# Altium project PowerMonitoring.PrjPcb
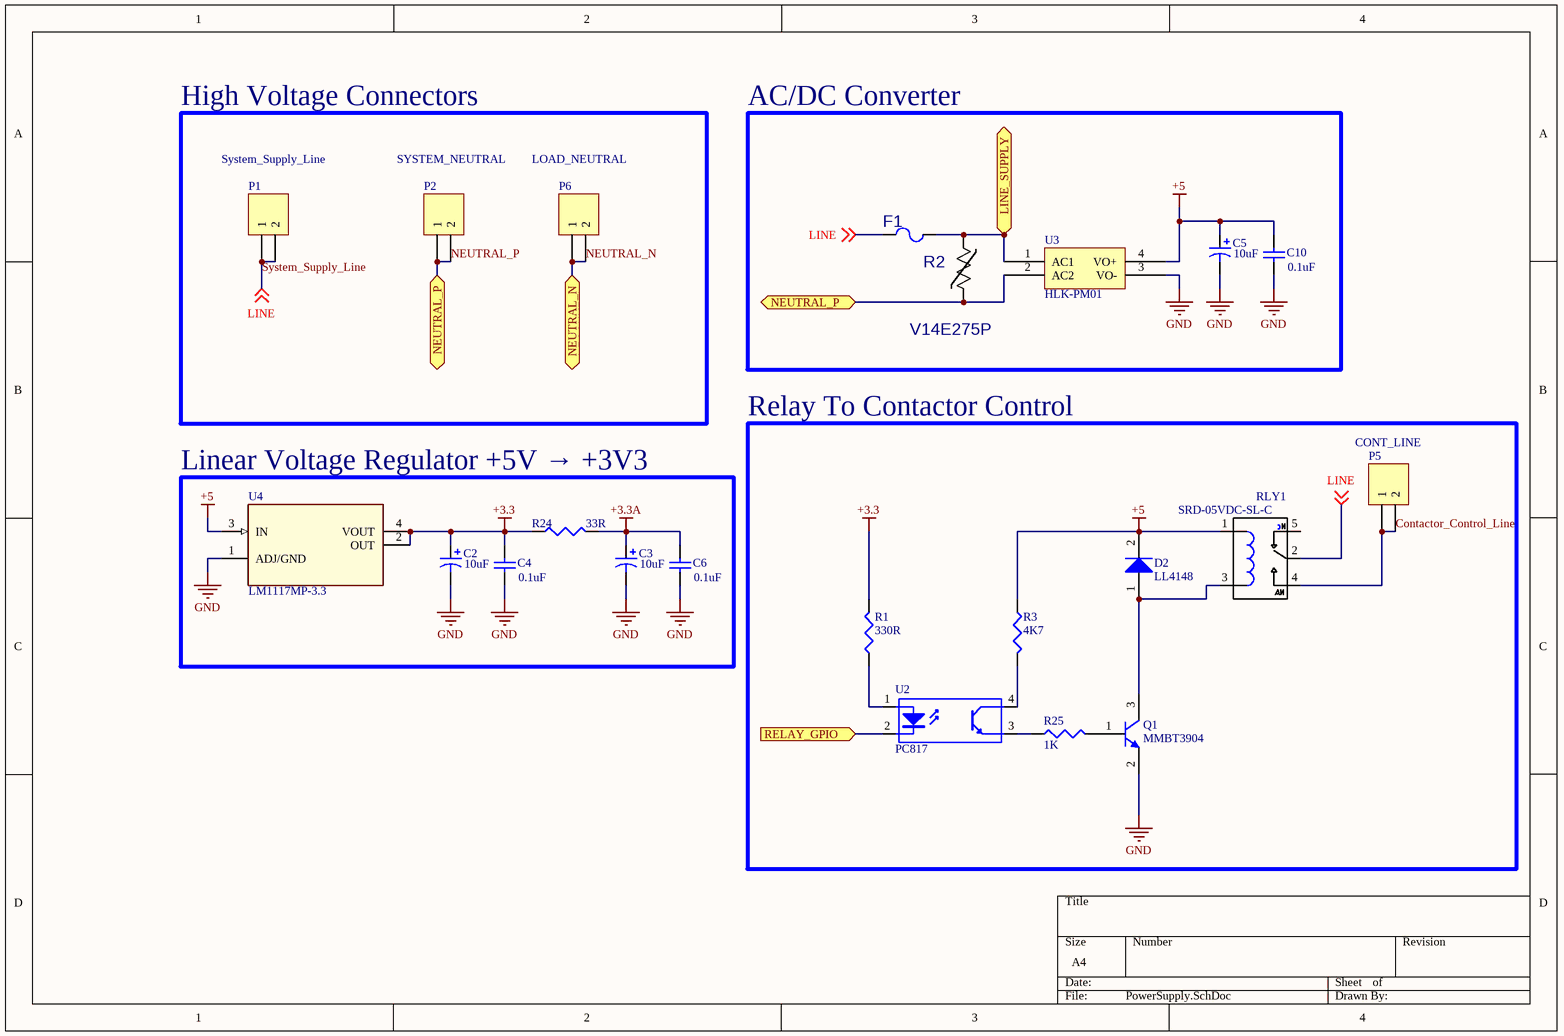
[diagram p0: PowerSupply.SchDoc]
3 sheets, 65 parts. Net scope: flat (ports and power ports of the same name join across sheets).
Board file: PowerMonitoring.PcbDoc
Sheets:
  PowerSupply.SchDoc
  CoreProcessor.SchDoc
  Meter.SchDoc

## Sheet PowerSupply.SchDoc
size A4

### Parts
C2  value 10uF  [EEE-1VA100WR]  (hidden comment: Cap Pol1)
C3  value 10uF  [EEE-1VA100WR]  (hidden comment: Cap Pol1)
C4  value 0.1uF  [C0603]  (hidden comment: MUDAR FOOTPRINT)
C5  value 10uF  [EEE-1VA100WR]  (hidden comment: Cap Pol1)
C6  value 0.1uF  [C0603]  (hidden comment: MUDAR FOOTPRINT)
C10  value 0.1uF  [C0603]  (hidden comment: MUDAR FOOTPRINT)
D2  LL4148  [LL4148]
F1  RSTA 1 AMMO  [RSTA]  (value not drawn)
P1  System_Supply_Line  [1993763]
P2  SYSTEM_NEUTRAL  [1993763]
P5  CONT_LINE  [1993763]
P6  LOAD_NEUTRAL  [1993763]
Q1  MMBT3904  [SOT-233]
R1  value 330R  [R0603]  (hidden comment: Res3)
R2  value V14E275P  [VARISTOR]  (hidden comment: ERZ-V14D431)
R3  value 4K7  [R0603]  (hidden comment: Res3)
R24  value 33R  [R0603]  (hidden comment: Res3)
R25  value 1K  [R0603]  (hidden comment: Res3)
RLY1  SRD-05VDC-SL-C  [srd-05vdc]
U2  PC817  [SOT254P975X400-4N]
U3  HLK-PM01  [HLK-PM01]
U4  LM1117MP-3.3  [LM1117]

### Blocks framed on the sheet
High Voltage Connectors: P1 P2 P6
AC/DC Converter: C5 C10 F1 R2 U3
Relay To Contactor Control: D2 P5 Q1 R1 R3 R25 RLY1 U2
Linear Voltage Regulator +5V → +3V3: C2-C4 C6 R24 U4

### Ports
LINE_SUPPLY (bidir), NEUTRAL_N (bidir), NEUTRAL_P (bidir), RELAY_GPIO (in)

### Nets
+3.3: C2.1 C4.2 R1.2 R24.1 U4.2(OUT) U4.4(VOUT)
+3.3A: C3.1 C6.2 R24.2
+5: C5.1 C10.2 D2.2(K) R3.1 RLY1.1 U3.4(VO+) U4.3(IN)
GND: C2.2 C3.2 C4.1 C5.2 C6.1 C10.1 Q1.2(E) U3.3(VO-) U4.1(ADJ/GND)  [project net AGND]
Contactor_Control_Line: P5.1 P5.2 RLY1.4
NEUTRAL_N: P6.1 P6.2 ; port NEUTRAL_N
NEUTRAL_P: P2.1 P2.2 R2.2 U3.2(AC2) ; port NEUTRAL_P
RELAY_GPIO: U2.2(K) ; port RELAY_GPIO
System_Supply_Line: F1.1 P1.1 P1.2 RLY1.2 ; off-sheet LINE  [also labelled LINE]
NetD2_1: D2.1(A) Q1.3(C) RLY1.3
NetF1_2: F1.2 R2.1 U3.1(AC1) ; port LINE_SUPPLY
NetQ1_1: Q1.1(B) R25.2
NetR1_1: R1.1 U2.1(A)
NetR3_2: R3.2 U2.4(C)
NetR25_1: R25.1 U2.3(E)

Not connected (* = marked no-connect by the designer): RLY1 5

### Library data of the parts
C2 C3 C5 = Cap Pol1: Polarized Capacitor (Radial); Published: 8-Jun-2000; LatestRevisionDate: 17-Jul-2002; LatestRevisionNote: Re-released for DXP Platform.; PackageReference: RB7.6-15; Publisher: Altium Limited; PackageDescription: Polarized Capacitor (Radial); 2 Leads
C4 C6 C10 = Cap Semi: Capacitor (Semiconductor SIM Model); Published: 8-Jun-2000; LatestRevisionDate: 29-May-2009; LatestRevisionNote: IPC-7351 Footprint Added.; PackageReference: C1206; Publisher: Altium Limited; PackageDescription: Chip Capacitor
D2 = Diode: Default Diode; Published: 8-Jun-2000; LatestRevisionDate: 17-Jul-2002; LatestRevisionNote: Re-released for DXP Platform.; PackageVersion: Sep-1996; PackageReference: SMC; Publisher: Altium Limited; PackageDescription: DO-214-AB/SMC; 2 C-Bend Leads; Body 7.9 x 5.9 mm, inc. leads (LxW); Code_JEDEC: DO-214-AB
F1 = RSTA 1 AMMO: Built_By: EMA_UL_Team; Vendor: BelFuse; Value: RSTA 1 AMMO; Manufacturer_Part_Number: RSTA 1 AMMO
P1 P2 P5 P6 = Header 2: Header, 2-Pin; LatestRevisionDate: 17-Jul-2002; LatestRevisionNote: Re-released for DXP Platform.; Publisher: Altium Limited
Q1 = NPN: NPN Bipolar Transistor; Published: 8-Jun-2000; LatestRevisionDate: 17-Jul-2002; LatestRevisionNote: Re-released for DXP Platform.; PackageReference: TO-226-AA; Publisher: Altium Limited; PackageDescription: TO, Flat Index; 3 In-Line, Axial Leads; Body Dia. 4.8mm; Leads 0.55 x 0.51 mm (max); Code_JEDEC: TO-226-AA
R1 R3 R24 R25 = Res3: Resistor; Published: 8-Jun-2000; LatestRevisionDate: 29-May-2009; LatestRevisionNote: IPC-7351 Footprint Added.; PackageReference: J1-0603; Publisher: Altium Limited; PackageDescription: Chip Resistor
R2 = ERZ-V14D431: C: Copyright (C) 2015 Accelerated Designs. All rights reserved; Vendor: Panasonic; Built_By: EMA_UL_Team; Manufacturer_Part_Number: ERZ-V14D431
RLY1 = SRD-05VDC-SL-C: 5V Trigger Relay Module For Arduino And Raspberry Pi 5V Trigger Relay Module For Arduino And Raspberry Pi; MF: MCM Electronics; Price: None; MP: SRD-05VDC-SL-C; Package: None; Availability: Unavailable; SnapEDA_Link: https://www.snapeda.com/parts/SRD-05VDC-SL-C/MCM%20Electronics/view-part/?ref=snap; Value: *
U2 = Optoisolator1: 4-Pin Phototransistor Optocoupler; Published: 24-Mar-1999; LatestRevisionDate: 04-Mar-2005; LatestRevisionNote: Sch pins 3 & 4 Swapped.; DatasheetVersion: Nov-2003; PackageReference: DIP-4; Publisher: Altium Limited
U4 = LM1117MP-3.3: LDO Regulator Pos 3.3V 0.8A 4-Pin_3+Tab_ SOT-223 T/R; MF: Texas Instruments; Package: SOT-223 Texas Instruments; MP: LM1117MP-3.3; Availability: Good; SnapEDA_Link: https://www.snapeda.com/parts/LM1117MP-3.3/Texas%20Instruments/view-part/?ref=snap; Price: 0.62 USD; Value: *

## Sheet CoreProcessor.SchDoc
size A4
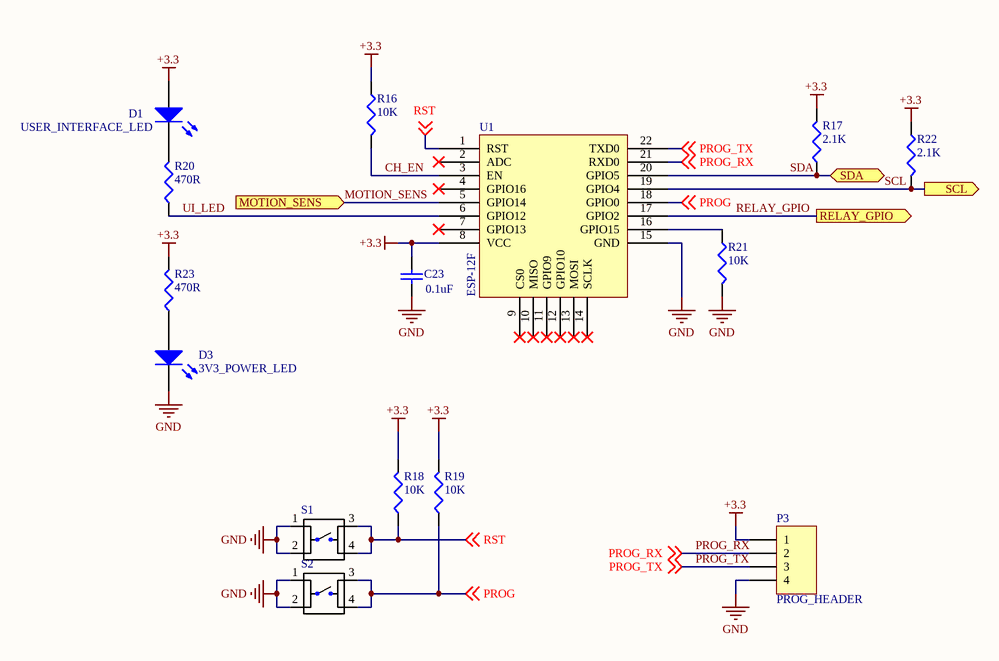
[diagram p1: CoreProcessor.SchDoc]

### Parts
C23  value 0.1uF  [C0603]  (hidden comment: MUDAR FOOTPRINT)
D1  USER_INTERFACE_LED  [LED0603]
D3  3V3_POWER_LED  [LED0603]
P3  PROG_HEADER  [HDR1X4]
R16  value 10K  [R0603]  (hidden comment: Res3)
R17  value 2.1K  [R0603]  (hidden comment: Res3)
R18  value 10K  [R0603]  (hidden comment: Res3)
R19  value 10K  [R0603]  (hidden comment: Res3)
R20  value 470R  [R0603]  (hidden comment: Res3)
R21  value 10K  [R0603]  (hidden comment: Res3)
R22  value 2.1K  [R0603]  (hidden comment: Res3)
R23  value 470R  [R0603]  (hidden comment: Res3)
S1  FSM8JH  [SW_FSM8JH]  (value not drawn)
S2  FSM8JH  [SW_FSM8JH]  (value not drawn)
U1  ESP-12F  [XCVR_ESP8266-12E/ESP-12E]

### Ports
MOTION_SENS (in), RELAY_GPIO (out), SCL (out), SDA (bidir)

### Nets
+3.3: C23.2 D1.2(A) P3.1 R16.1 R17.2 R18.2 R19.2 R22.2 R23.2 U1.8(VCC)
GND: C23.1 D3.1(K) P3.4 R21.2 S1.1 S1.2 S2.1 S2.2 U1.15(GND)  [project net AGND]
CH_EN: R16.2 U1.3(EN)
MOTION_SENS: U1.5(GPIO14) ; port MOTION_SENS
PROG: R19.1 S2.3 S2.4 U1.18(GPIO0) ; off-sheet PROG
PROG_RX: P3.2 U1.21(RXD0) ; off-sheet PROG_RX
PROG_TX: P3.3 U1.22(TXD0) ; off-sheet PROG_TX
RELAY_GPIO: U1.17(GPIO2) ; port RELAY_GPIO
RST: R18.1 S1.3 S1.4 U1.1(RST) ; off-sheet RST
SCL: R22.1 U1.19(GPIO4) ; port SCL
SDA: R17.1 U1.20(GPIO5) ; port SDA
UI_LED: R20.1 U1.6(GPIO12)
NetD1_1: D1.1(K) R20.2
NetD3_2: D3.2(A) R23.1
NetR21_1: R21.1 U1.16(GPIO15)

Not connected (* = marked no-connect by the designer): U1 2(ADC)* 4(GPIO16)* 7(GPIO13)* 9(CS0)* 10(MISO)* 11(GPIO9)* 12(GPIO10)* 13(MOSI)* 14(SCLK)*

### Notes on the sheet
- Title
- Size:
- Date:
- A4
- Number:
- Time:
- Revision:
- Sheet
- of
- File:

### Library data of the parts
C23 = Cap Semi: Capacitor (Semiconductor SIM Model); Published: 8-Jun-2000; LatestRevisionDate: 29-May-2009; LatestRevisionNote: IPC-7351 Footprint Added.; PackageReference: C1206; Publisher: Altium Limited; PackageDescription: Chip Capacitor
D1 D3 = LED0: Typical INFRARED GaAs LED; Published: 8-Jun-2000; LatestRevisionDate: 08-Jul-2005; LatestRevisionNote: Mech Layer 1 removed.; PackageReference: LED-0; Publisher: Altium Limited; PackageDescription: LED; 2 Leads
P3 = Header 4: Header, 4-Pin; LatestRevisionDate: 17-Jul-2002; LatestRevisionNote: Re-released for DXP Platform.; Publisher: Altium Limited
R16-R23 = Res3: Resistor; Published: 8-Jun-2000; LatestRevisionDate: 29-May-2009; LatestRevisionNote: IPC-7351 Footprint Added.; PackageReference: J1-0603; Publisher: Altium Limited; PackageDescription: Chip Resistor
S1 S2 = BUTTON: Switch, Pushbutton, Tactile, SPST, Thru Hole, Vertical, 6MM, Black; MF: TE Connectivity / Alcoswitch; Availability: Good; Price: 0.07 USD; Package: None; MP: FSM8JH; SnapEDA_Link: https://www.snapeda.com/parts/FSM8JH/TE%2520Connectivity%2520/%2520Alcoswitch/view-part/?ref=snap; Value: *

## Sheet Meter.SchDoc
size A4
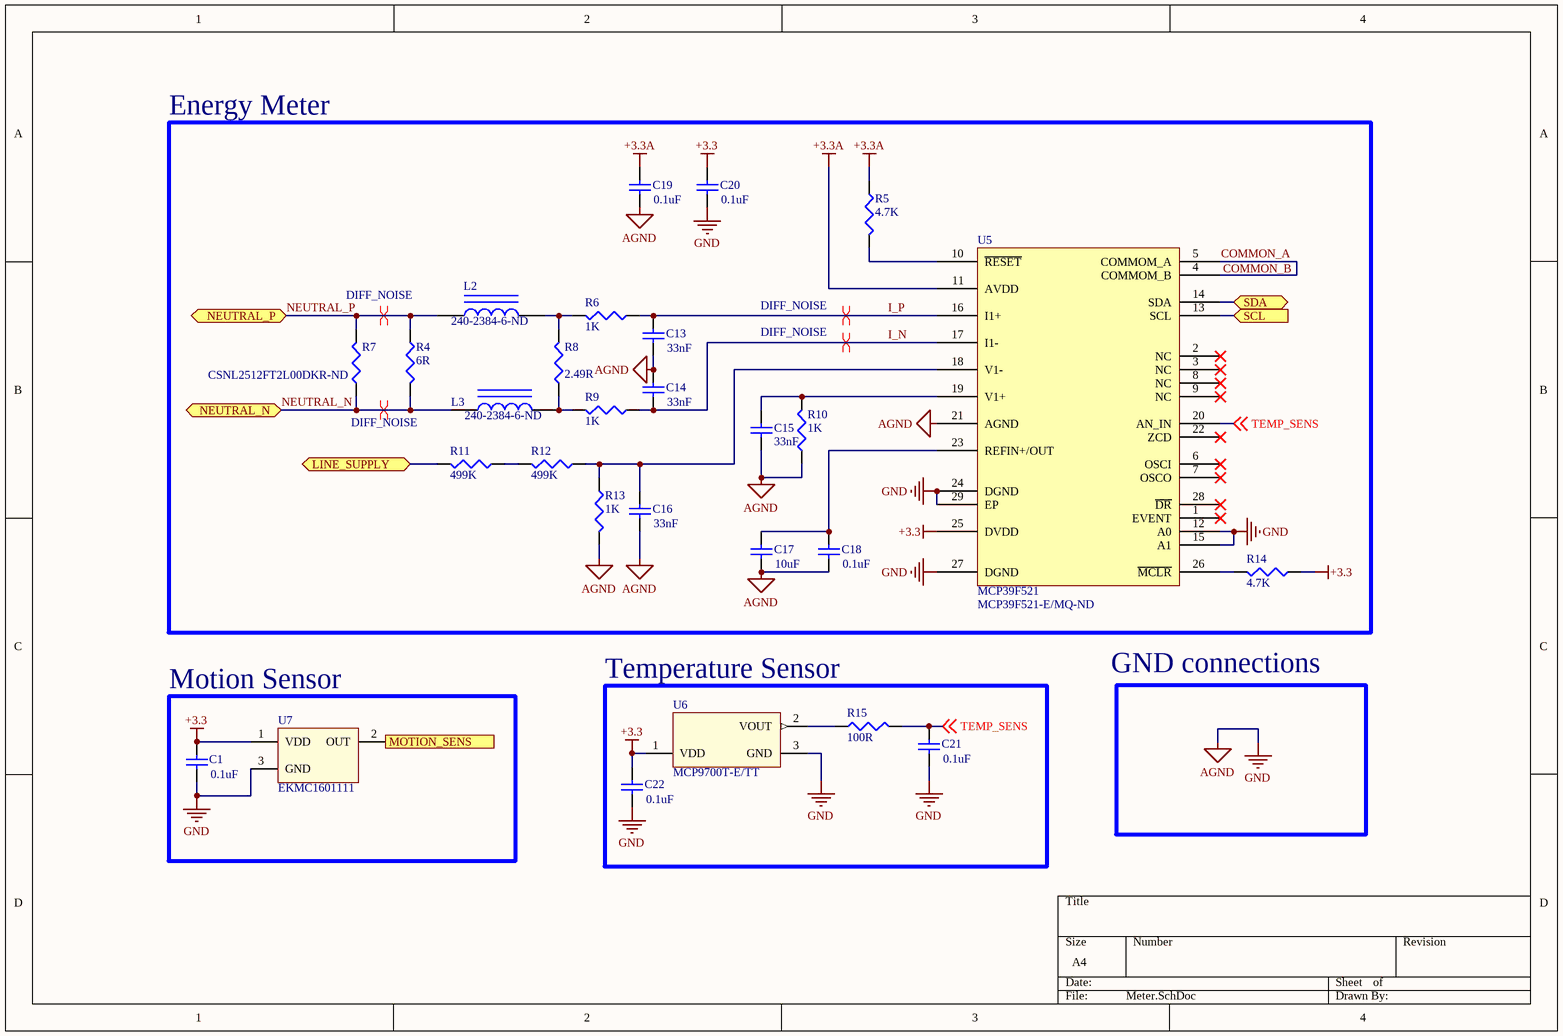
[diagram p2: Meter.SchDoc]

### Parts
C1  value 0.1uF  [C0603]  (hidden comment: MUDAR FOOTPRINT)
C13  value 33nF  [C0603]  (hidden comment: MUDAR FOOTPRINT)
C14  value 33nF  [C0603]  (hidden comment: MUDAR FOOTPRINT)
C15  value 33nF  [C0603]  (hidden comment: MUDAR FOOTPRINT)
C16  value 33nF  [C0603]  (hidden comment: MUDAR FOOTPRINT)
C17  value 10uF  [C0805]  (hidden comment: MUDAR FOOTPRINT)
C18  value 0.1uF  [C0603]  (hidden comment: MUDAR FOOTPRINT)
C19  value 0.1uF  [C0603]  (hidden comment: MUDAR FOOTPRINT)
C20  value 0.1uF  [C0603]  (hidden comment: MUDAR FOOTPRINT)
C21  value 0.1uF  [C0603]  (hidden comment: MUDAR FOOTPRINT)
C22  value 0.1uF  [C0603]  (hidden comment: MUDAR FOOTPRINT)
L2  Supplier Part Number 1: 240-2384-6-ND  [6-0805_N]  (hidden comment: FERRITE BEAD)
L3  Supplier Part Number 1: 240-2384-6-ND  [6-0805_N]  (hidden comment: FERRITE BEAD)
R4  value 6R  [R0603]  (hidden comment: Res3)
R5  value 4.7K  [R0603]  (hidden comment: Res3)
R6  value 1K  [R0603]  (hidden comment: Res3)
R7  Supplier Part Number 1: CSNL2512FT2L00DKR-ND  [RES2512]  (hidden comment: SHUNT)
R8  value 2.49R  [R0603]  (hidden comment: Res3)
R9  value 1K  [R0603]  (hidden comment: Res3)
R10  value 1K  [R0603]  (hidden comment: Res3)
R11  value 499K  [12Z-2010]  (hidden comment: Res3)
R12  value 499K  [12Z-2010]  (hidden comment: Res3)
R13  value 1K  [R0603]  (hidden comment: Res3)
R14  value 4.7K  [R0603]  (hidden comment: Res3)
R15  value 100R  [R0603]  (hidden comment: Res3)
U5  MCP39F521  Supplier Part Number 1: MCP39F521-E/MQ-ND  [MCP39F521]
U6  MCP9700T-E/TT  [SOT-233]
U7  EKMC1601111  [EKMC1601111]

### Blocks framed on the sheet
Energy Meter: C13-C20 L2 L3 R4-R14 U5
Motion Sensor: C1 U7
Temperature Sensor: C21 C22 R15 U6

### Ports
LINE_SUPPLY (bidir), MOTION_SENS (out), NEUTRAL_N (bidir), NEUTRAL_P (bidir), SCL (in), SDA (bidir)

### Nets
+3.3: C1.2 C20.2 C22.2 R14.2 U5.25(DVDD) U6.1(VDD) U7.1(VDD)
+3.3A: C19.2 R5.1 U5.11(AVDD)
AGND: C1.1 C13.1 C14.2 C15.1 C16.1 C17.1 C18.1 C19.1 C20.1 C21.1 C22.1 R10.2 R13.2 U5.12(A0) U5.15(A1) U5.21(AGND) U5.24(DGND) U5.27(DGND) U5.29(EP) U6.3(GND) U7.3(GND)  [also labelled GND]
COMMON_A: U5.4(COMMOM_B) U5.5(COMMOM_A)
I_N: C14.1 R9.1 U5.17(I1-)
I_P: C13.2 R6.1 U5.16(I1+)
MOTION_SENS: U7.2(OUT) ; port MOTION_SENS
NEUTRAL_N: L3.1 R4.2 R7.1 ; port NEUTRAL_N
NEUTRAL_P: L2.1 R4.1 R7.2 ; port NEUTRAL_P
SCL: U5.13(SCL) ; port SCL
SDA: U5.14(SDA) ; port SDA
TEMP_SENS: C21.2 R15.2 U5.20(AN_IN) ; off-sheet TEMP_SENS
NetC15_2: C15.2 R10.1 U5.19(V1+)
NetC16_2: C16.2 R12.1 R13.1 U5.18(V1-)
NetC17_2: C17.2 C18.2 U5.23(REFIN+/OUT)
NetF1_2: R11.2 ; port LINE_SUPPLY
NetL2_2: L2.2 R6.2 R8.2
NetL3_2: L3.2 R8.1 R9.2
NetR5_2: R5.2 U5.10(~{RESET})
NetR11_1: R11.1 R12.2
NetR14_1: R14.1 U5.26(~{MCLR})
NetR15_1: R15.1 U6.2(VOUT)

Not connected (* = marked no-connect by the designer): U5 1(EVENT)* 2(NC)* 3(NC)* 6(OSCI)* 7(OSCO)* 8(NC)* 9(NC)* 22(ZCD)* 28(~{DR})*

### Layout directives
differential pair; net class DIFF_NOISE: I_N, I_P, NEUTRAL_N, NEUTRAL_P

### Notes on the sheet
- GND connections
- Labels drawn without touching a wire or pin: COMMON_B

### Library data of the parts
C1 C13-C22 = Cap Semi: Capacitor (Semiconductor SIM Model); Published: 8-Jun-2000; LatestRevisionDate: 29-May-2009; LatestRevisionNote: IPC-7351 Footprint Added.; PackageReference: C1206; Publisher: Altium Limited; PackageDescription: Chip Capacitor
L2 L3 = Inductor Iron: Magnetic-Core Inductor; Value: 10mH; Published: 24-Mar-1999; LatestRevisionDate: 17-Jul-2002; LatestRevisionNote: Re-released for DXP Platform.; PackageReference: AXIAL-0.9; Publisher: Altium Limited; PackageDescription: Axial Device, Thru-Hole; 2 Leads; 0.9 in Pin Spacing; Supplier 1: Digi-Key
R4-R6 R8-R15 = Res3: Resistor; Published: 8-Jun-2000; LatestRevisionDate: 29-May-2009; LatestRevisionNote: IPC-7351 Footprint Added.; PackageReference: J1-0603; Publisher: Altium Limited; PackageDescription: Chip Resistor
R7 = Res3: Resistor; Value: CSNL2512FT2L00DKR-ND; Published: 8-Jun-2000; LatestRevisionDate: 29-May-2009; LatestRevisionNote: IPC-7351 Footprint Added.; PackageReference: J1-0603; Publisher: Altium Limited; PackageDescription: Chip Resistor; Supplier 1: Digi-Key
U6 = MCP9700T-E/TT: MCP9700 Series 5 V -40 to +125Â°C Low-Power Linear Active Thermistor; MF: Microchip; SnapEDA_Link: https://www.snapeda.com/parts/MCP9700T-E/TT/Microchip/view-part/?ref=snap; Price: None; Package: SOT-23-3 Microchip; MP: MCP9700T-E/TT; Availability: Unavailable; Value: *
U7 = EKMC1601111: Board Mount Motion & Position Sensors Digital 170uA 5m White; Manufacturer_Name: Panasonic; Manufacturer_Part_Number: EKMC1601111; RS Part Number: 1357095; RS Price/Stock: http://uk.rs-online.com/web/p/products/1357095; Arrow Part Number: EKMC1601111; Arrow Price/Stock: https://www.arrow.com/en/products/ekmc1601111/panasonic; Datasheet Link: http://www3.panasonic.biz/ac/e/search_num/index.jsp?c=detail&part_no=EKMC1601111
U5 = MCP39F521: Supplier 1: Digi-Key

## Nets that join several sheets
+3.3: PowerSupply (6 pins), CoreProcessor (10 pins), Meter (7 pins)
+3.3A: PowerSupply (C3.1 C6.2 R24.2), Meter (C19.2 R5.1 U5.11)
AGND: PowerSupply (9 pins), CoreProcessor (9 pins), Meter (21 pins)
MOTION_SENS: CoreProcessor (U1.5), Meter (U7.2)
NetF1_2: PowerSupply (F1.2 R2.1 U3.1), Meter (R11.2)
NEUTRAL_N: PowerSupply (P6.1 P6.2), Meter (L3.1 R4.2 R7.1)
NEUTRAL_P: PowerSupply (P2.1 P2.2 R2.2 U3.2), Meter (L2.1 R4.1 R7.2)
RELAY_GPIO: PowerSupply (U2.2), CoreProcessor (U1.17)
SCL: CoreProcessor (R22.1 U1.19), Meter (U5.13)
SDA: CoreProcessor (R17.1 U1.20), Meter (U5.14)